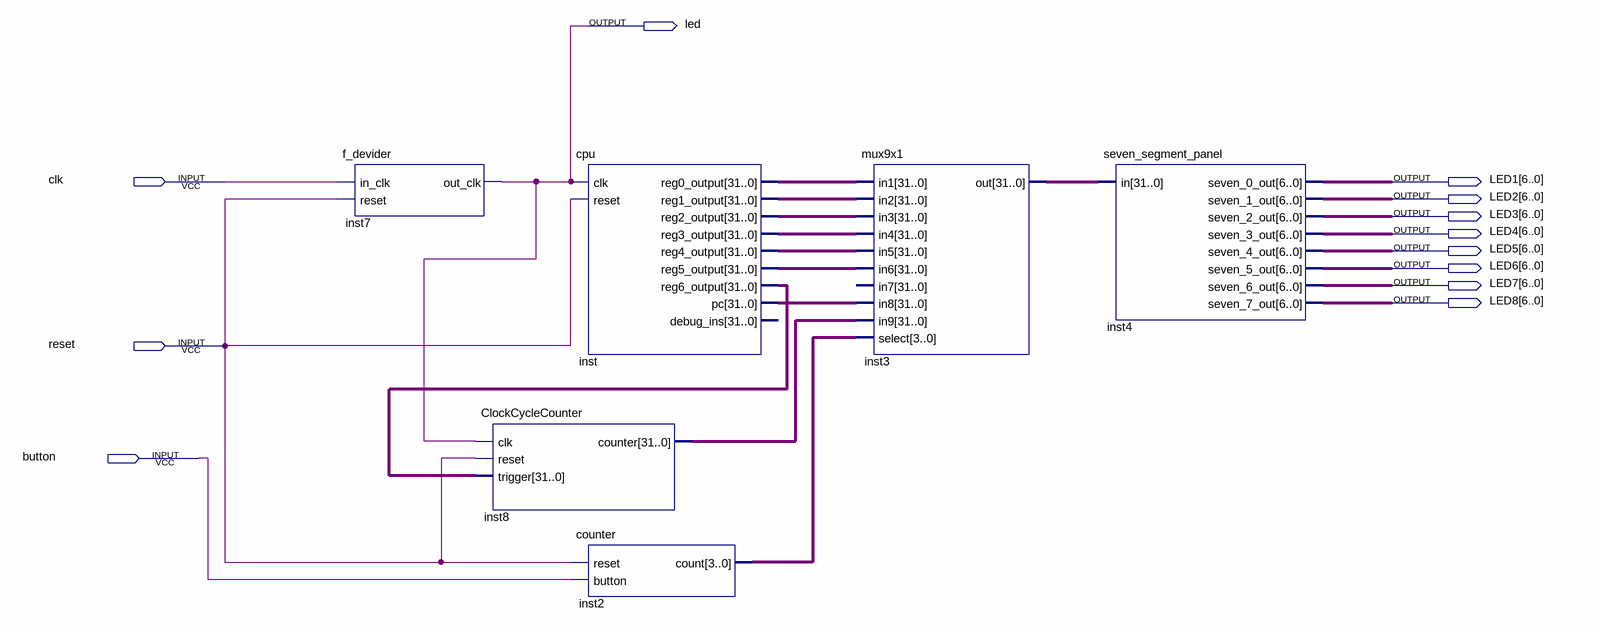
[diagram p0: schematic sheet]
// Quartus schematic riscv.bdf as structural Verilog: 6 symbols, 12 pins
module riscv (
  input  clk,
  input  reset,
  input  button,
  output led,
  output [6:0] LED1,
  output [6:0] LED2,
  output [6:0] LED3,
  output [6:0] LED4,
  output [6:0] LED5,
  output [6:0] LED6,
  output [6:0] LED7,
  output [6:0] LED8
);

  wire [3:0] inst2_count;
  wire [31:0] inst3_out, inst8_counter, inst_pc, inst_reg0_output, inst_reg1_output, inst_reg2_output,
       inst_reg3_output, inst_reg4_output, inst_reg5_output, inst_reg6_output;

  f_devider inst7 (.in_clk(clk), .reset(reset), .out_clk(led));
  ClockCycleCounter inst8 (.clk(led), .reset(reset), .trigger(inst_reg6_output), .counter(inst8_counter));
  cpu inst (
    .clk(led), .reset(reset), .reg0_output(inst_reg0_output), .reg1_output(inst_reg1_output),
    .reg2_output(inst_reg2_output), .reg3_output(inst_reg3_output), .reg4_output(inst_reg4_output),
    .reg5_output(inst_reg5_output), .reg6_output(inst_reg6_output), .pc(inst_pc));  // open: debug_ins
  counter inst2 (.reset(reset), .button(button), .count(inst2_count));
  mux9x1 inst3 (
    .in1(inst_reg0_output), .in2(inst_reg1_output), .in3(inst_reg2_output), .in4(inst_reg3_output),
    .in5(inst_reg4_output), .in6(inst_reg5_output), .in8(inst_pc), .in9(inst8_counter), .select(inst2_count),
    .out(inst3_out));  // open: in7
  seven_segment_panel inst4 (
    .in(inst3_out), .seven_0_out(LED1), .seven_1_out(LED2), .seven_2_out(LED3), .seven_3_out(LED4),
    .seven_4_out(LED5), .seven_5_out(LED6), .seven_6_out(LED7), .seven_7_out(LED8));
endmodule
